# Altium schematic sheet SD Card.SchDoc
size A3; SheetNumber: 5; SheetTotal: 8
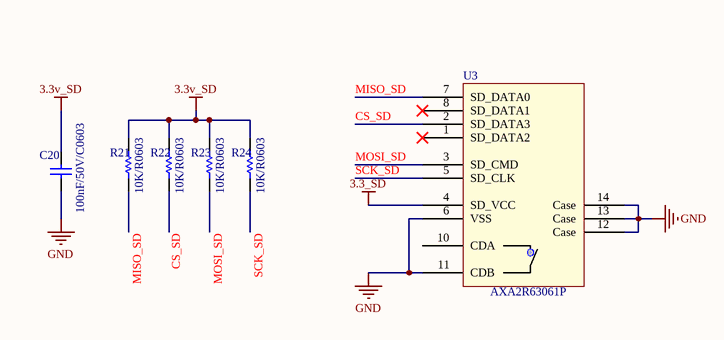
[diagram p0: SD Card.SchDoc]

## Parts
C20  100nF/50V/C0603  [C0603]
R21  10K/R0603  [R0603]
R22  10K/R0603  [R0603]
R23  10K/R0603  [R0603]
R24  10K/R0603  [R0603]
U3  AXA2R63061P  [mini SD card - T-flash]

## Nets
3.3_SD: U3.4(SD_VCC)
3.3v_SD: C20.2 R21.2 R22.2 R23.2 R24.2
GND: C20.1 U3.6(VSS) U3.11(CDB) U3.12(Case) U3.13(Case) U3.14(Case)
CS_SD: U3.2(SD_DATA3)
MISO_SD: R21.1 U3.7(SD_DATA0)
MOSI_SD: R23.1 U3.3(SD_CMD)
SCK_SD: R24.1 U3.5(SD_CLK)

Not connected (* = marked no-connect by the designer): R22 1; U3 1(SD_DATA2)* 8(SD_DATA1)* 10(CDA)

## Notes on the sheet
- Labels drawn without touching a wire or pin: CS_SD
- Title
- Size:
- Date:
- A3
- Number:
- Time:
- Revision:
- Sheet
- of
- NICHIETSUVN.COM <http://NICHIETSUVN.COM>
- R&D
- File:

## Library data of the parts
C20 = 0.1uF/50V/C0603/10%: CAP CER 0.1UF 50V 10% X7R 0603; Manufacturer: Murata Electronics North America; Manufacturer Part Number: GRM188R71H104KA93D; Capacitance: 0.1µF; RoHS: RoHS Compliant; Category: Capacitors; Packaging: Tape & Reel (TR); Tolerance: ±10%; Voltage - Rated: 50V; Temperature Coefficient: X7R; Mounting Type: Surface Mount, MLCC; Operating Temperature: -55°C ~ 125°C; Applications: General Purpose; Ratings: -; Package / Case: 0603 (1608 Metric); Size / Dimension: 0.063" L x 0.031" W (1.60mm x 0.80mm); Height - Seated (Max): -; Thickness (Max): 0.035" (0.90mm); Lead Spacing: -; Features: -; Lead Style: -; ComponentLink1URL: http://www.murata.com/~/media/webrenewal/support/library/catalog/products/capacitor/mlcc/c02e.ashx; ComponentLink1Description: http://www.murata.com/~/media/webrenewal/support/library/catalog/products/capacitor/mlcc/c02e.ashx; Supplier 1: Digi-Key; Supplier Part Number 1: 490-1519-1-ND
R21-R24 = 10K/R0603/1%: RES SMD 10K OHM 1% 1/10W 0603; Manufacturer: Yageo; Manufacturer Part Number: RC0603FR-0710KL; Power (Watts): 0.1W, 1/10W; Temperature Coefficient: ±100ppm/°C; Supplier 1: Digi-Key; RoHS: RoHS Compliant; Category: Resistors; Stock 1: 11440000; Pricing 1: 5000=0.00167, 10000=0.00145, 25000=0.00128, 50000=0.00117, 125000=0.00115 (USD); Packaging: Tape & Reel (TR); Resistance (Ohms): 10k; Tolerance: ±1%; Composition: Thick Film; Features: Moisture Resistant; Operating Temperature: -55°C ~ 155°C; Package / Case: 0603 (1608 Metric); Supplier Device Package: 0603; Size / Dimension: 0.063" L x 0.031" W (1.60mm x 0.80mm); Height: 0.022" (0.55mm); Number of Terminations: 2; ComponentLink1URL: http://www.yageo.com/NewPortal/yageodocoutput?fileName=/pdf/R-Chip/PYu-RC_Group_51_RoHS_L_3.pdf; ComponentLink1Description: http://www.yageo.com/NewPortal/yageodocoutput?fileName=/pdf/R-Chip/PYu-RC_Group_51_RoHS_L_3.pdf; Supplier Part Number 1: 311-10.0KHRTR-ND; PN_LCSC: *; Link_LCSC: *; DNI: *
U3 = MICRO SD CARD P-P R/A SMD: CONN SD CARD PUSH-PUSH R/A SMD; Manufacturer: Panasonic Electric Works; Card Type: Secure Digital - SD; Number of Positions: 12 (9 + 3); Connector Type: Connector and Ejector; Insertion, Removal Method: Push In, Push Out; Supplier 1: Digi-Key; Manufacturer Part Number: AXA2R63061P; RoHS: RoHS Compliant; Category: Connectors, Interconnects; Stock 1: 0; Pricing 1: 350=0 (USD); Packaging: Tape & Reel (TR); Part Status: Obsolete; Ejector Side: -; Mounting Type: Surface Mount, Right Angle; Features: Board Guide, Switch; Height Above Board: 0.134" (3.40mm); Mounting Feature: Normal, Standard - Top; Contact Finish: Gold; Contact Finish Thickness: Flash; ComponentLink1URL: http://media.digikey.com/pdf/Data%20Sheets/Panasonic%20Electric%20Works%20PDFs/AXA2R%20Rev.Oct1,2009.pdf; ComponentLink1Description: http://media.digikey.com/pdf/Data%20Sheets/Panasonic%20Electric%20Works%20PDFs/AXA2R%20Rev.Oct1,2009.pdf